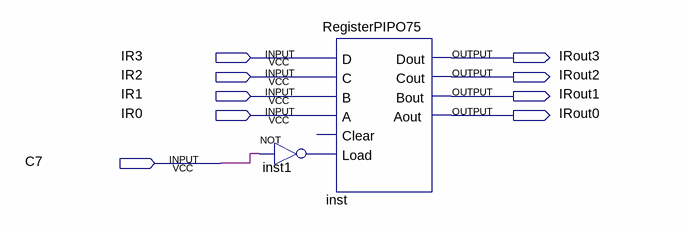
[diagram p0: schematic sheet]
// Quartus schematic IR.bdf as structural Verilog: 2 symbols, 9 pins
module IR (
  input  IR3,
  input  IR2,
  input  IR1,
  input  IR0,
  input  C7,
  output IRout3,
  output IRout2,
  output IRout1,
  output IRout0
);

  wire inst1_out;

  not inst1 (inst1_out, C7);
  RegisterPIPO75 inst (
    .D(IR3), .C(IR2), .B(IR1), .A(IR0), .Load(inst1_out), .Dout(IRout3), .Cout(IRout2), .Bout(IRout1),
    .Aout(IRout0));  // open: Clear
endmodule
